# EAGLE schematic breadboard_rev01 (EAGLE 6.1)
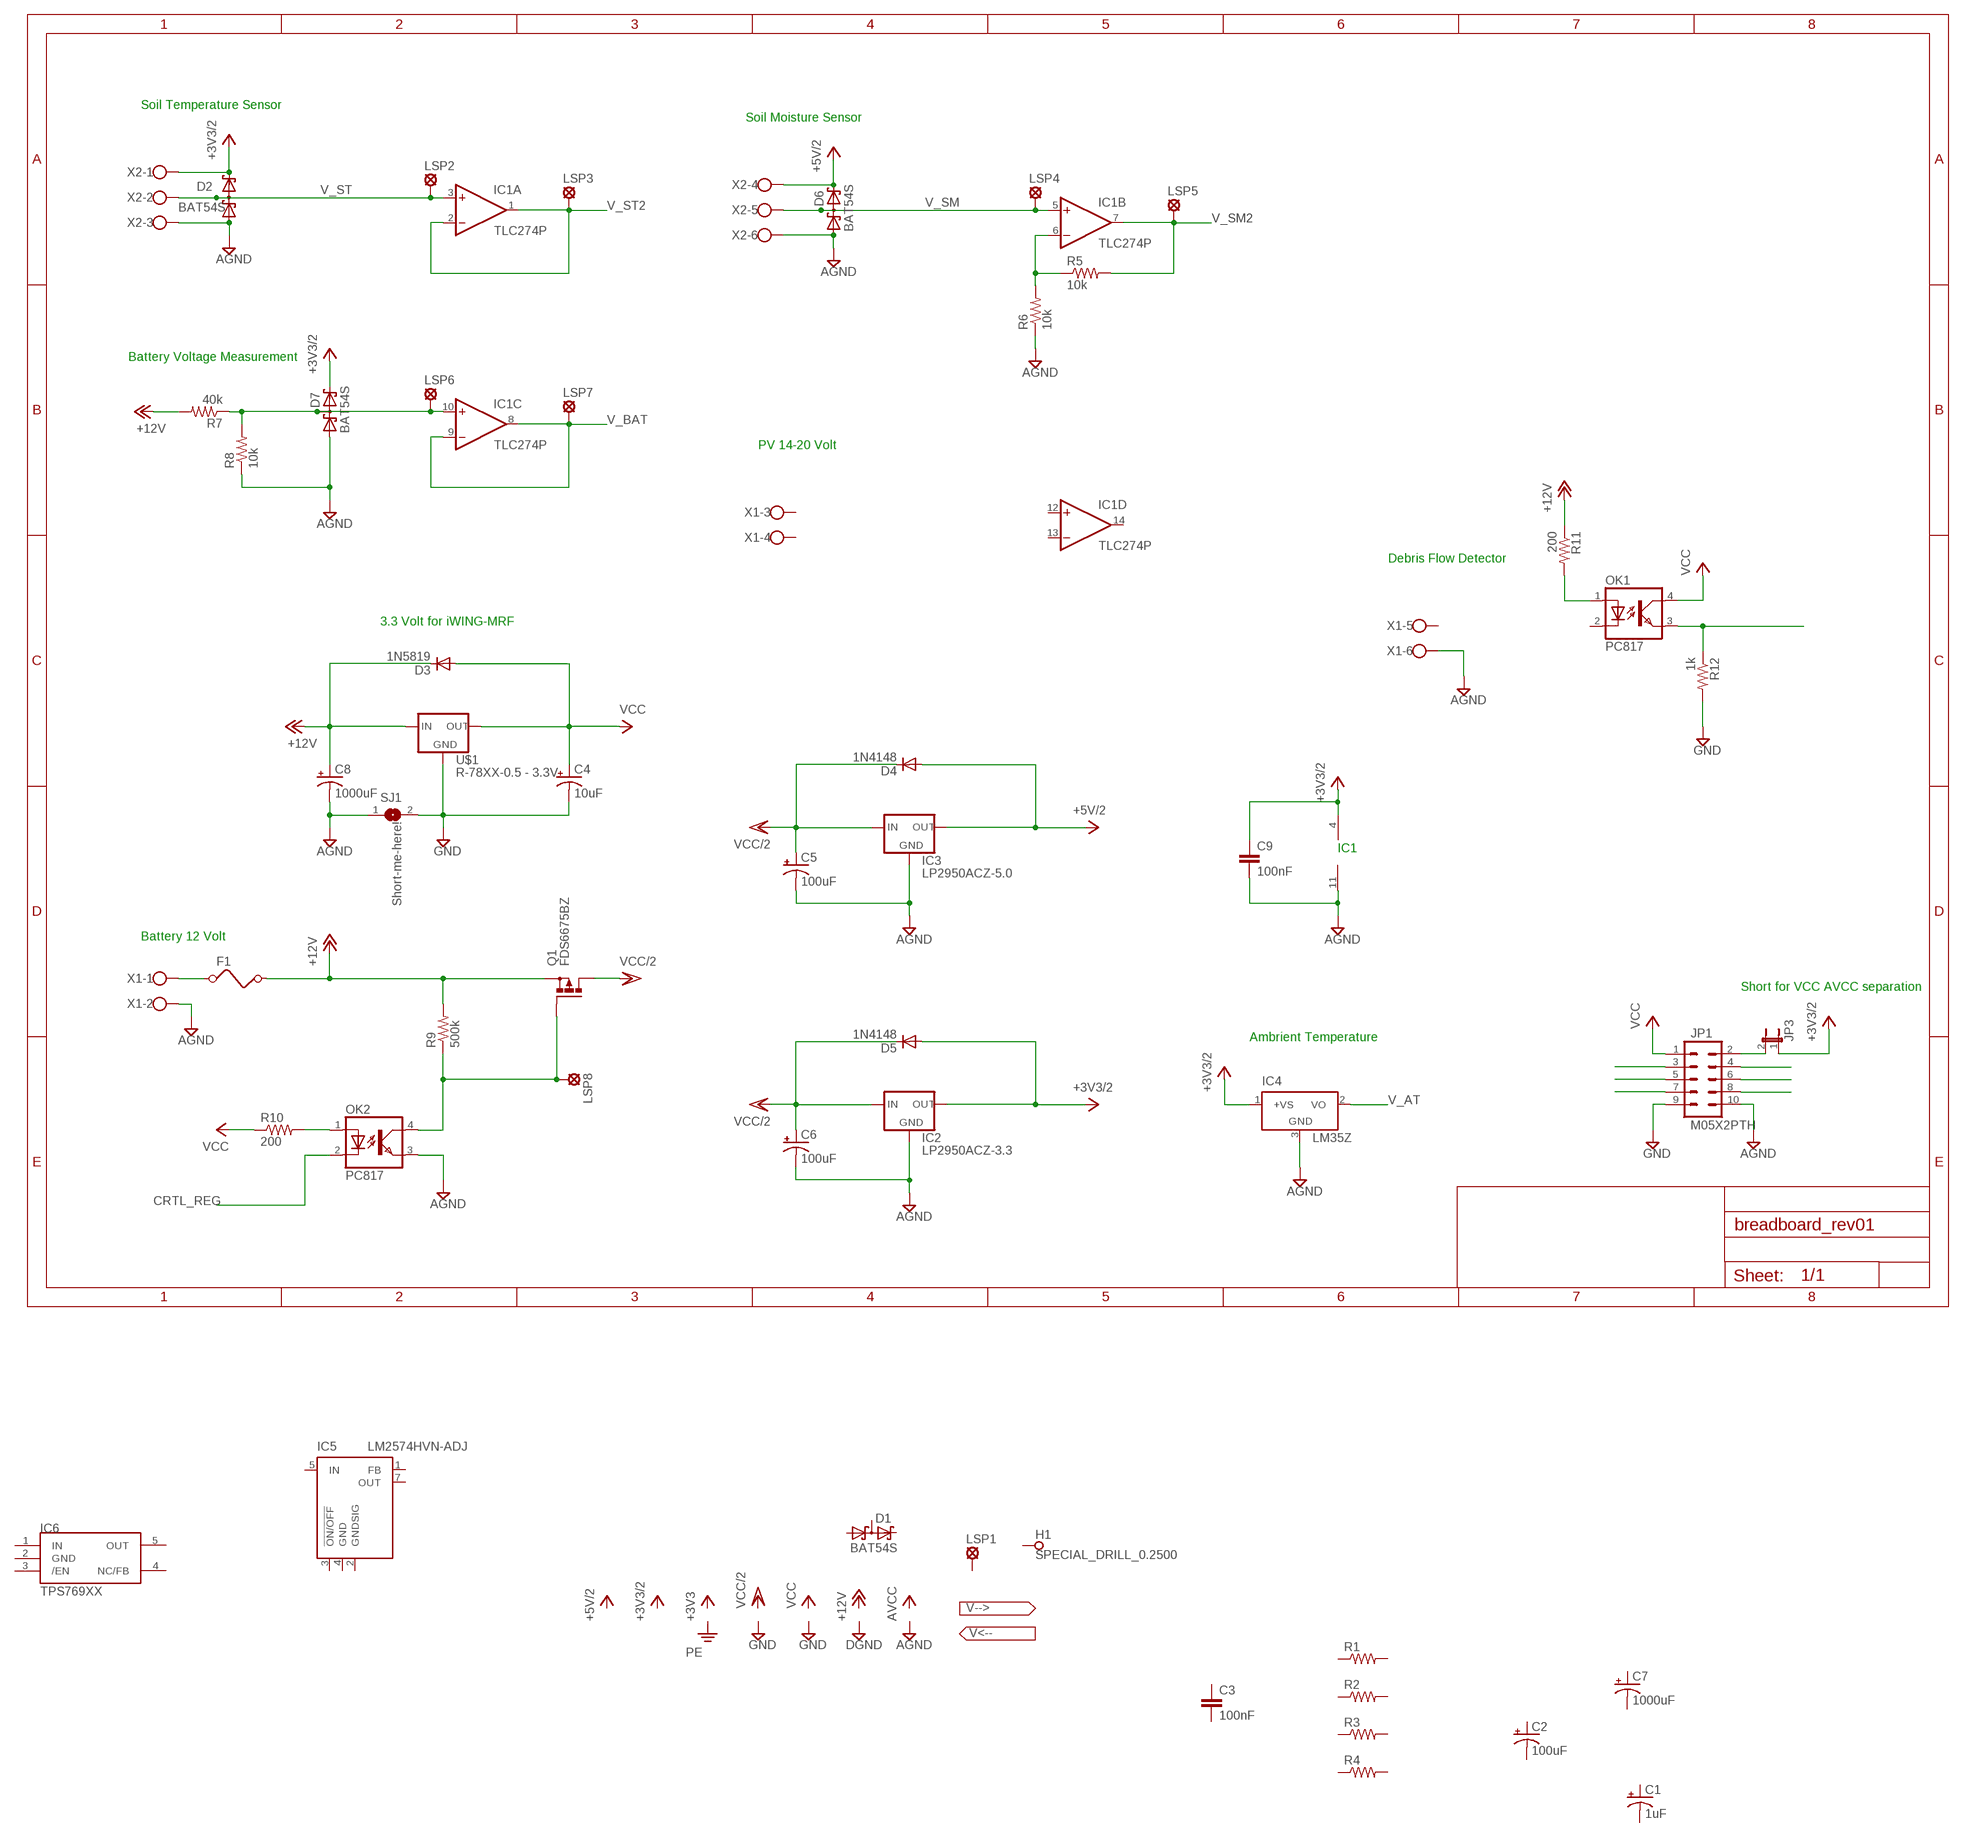
[diagram p0: schematic, sheet 1]

## Parts
C1  1uF  RCL_CPOL-USE2-5  [RCL_E2-5]
C2  100uF  RCL_CPOL-USE2.5-7  [RCL_E2,5-7]
C3  100nF  RCL_C-EU050-025X075  [RCL_C050-025X075]
C4  10uF  RCL_CPOL-USE2.5-7  [RCL_E2,5-7]
C5  100uF  RCL_CPOL-USE2.5-7  [RCL_E2,5-7]
C6  100uF  RCL_CPOL-USE2.5-7  [RCL_E2,5-7]
C7  1000uF  RCL_CPOL-USE5-13  [RCL_E5-13]
C8  1000uF  RCL_CPOL-USE5-13  [RCL_E5-13]
C9  100nF  RCL_C-EU050-025X075  [RCL_C050-025X075]
D1  BAT54S  [SOT23]
D2  BAT54S  [SOT23]
D3  1N5819  [DO41-10]
D4  1N4148  [DO35-10]
D5  1N4148  [DO35-10]
D6  BAT54S  [SOT23]
D7  BAT54S  [SOT23]
F1  FUSE  [FUSE]
H1  SPECIAL_DRILL_0.2500  [PAD_0.2500]
IC1  TLC274P  [DIL14]
IC2  LP2950ACZ-3.3  [TO92]
IC3  LP2950ACZ-5.0  [TO92]
IC4  LM35Z  [TO92]
IC5  LM2574HVN-ADJ  [DIL08]
IC6  TPS769XX  [SOT23-5L]
JP1  M05X2PTH  [AVR_ICSP]
JP3  JP1E  [JUMPER_JP1]
LSP1  LSP13  [LSP13]
LSP2  LSP13  [LSP13]
LSP3  LSP13  [LSP13]
LSP4  LSP13  [LSP13]
LSP5  LSP13  [LSP13]
LSP6  LSP13  [LSP13]
LSP7  LSP13  [LSP13]
LSP8  LSP13  [LSP13]
OK1  PC817  [DIL04]
OK2  PC817  [DIL04]
Q1  FDS6675BZ  P-MOSFET-SO8  [SO-08]
R1  RCL_R-US_0204/7  [RCL_0204/7]
R2  RCL_R-US_0204/7  [RCL_0204/7]
R3  RCL_R-US_0204/7  [RCL_0204/7]
R4  RCL_R-US_0204/7  [RCL_0204/7]
R5  10k  RCL_R-US_0204/7  [RCL_0204/7]
R6  10k  RCL_R-US_0204/7  [RCL_0204/7]
R7  40k  RCL_R-US_0204/7  [RCL_0204/7]
R8  10k  RCL_R-US_0204/7  [RCL_0204/7]
R9  500k  RCL_R-US_0204/7  [RCL_0204/7]
R10  200  RCL_R-US_0204/7  [RCL_0204/7]
R11  200  RCL_R-US_0204/7  [RCL_0204/7]
R12  1k  RCL_R-US_0204/7  [RCL_0204/7]
SJ1  Short-me-here!  SJ  [SJ]
U$1  R-78XX-0.5 - 3.3V  R-78XX-0.5  [SIP3]
X1  5EHDRC-6P  [5EHDRC-6P]
X2  5EHDRC-6P  [5EHDRC-6P]

## Nets
+3V3/2: C9.1 D2.3(C2) D5.A D7.3(C2) IC1.4(P:V+) IC2.1(OUT) IC4.1(+VS) JP3.1 X2.1
+5V/2: D4.A D6.3(C2) IC3.1(OUT) X2.4
+12V: C8.+ F1.2 Q1.1(S) Q1.2(S) Q1.3(S) R7.2 R9.2 R11.1 U$1.1(IN)
AGND: C5.- C6.- C8.- C9.2 D2.1(A1) D6.1(A1) D7.1(A1) IC1.11(P:V-) IC2.2(GND) IC3.2(GND) IC4.3(GND) JP1.10 OK2.3(EMIT) R6.1 R8.1 SJ1.1 X1.2 X1.6 X2.3 X2.6
CRTL_REG: OK2.2(C)
GND: C4.- JP1.9 R12.2 SJ1.2 U$1.2(GND)
N$1: D7.2(C1A2) IC1.10(C:+IN) LSP6.MP R7.1 R8.2
N$2: F1.1 X1.1
N$3: IC1.6(B:-IN) R5.1 R6.2
N$4: JP1.3
N$5: JP1.5
N$6: JP1.7
N$7: JP1.4
N$8: JP1.6
N$9: JP1.8
N$10: LSP8.MP OK2.4(COL) Q1.4(G) R9.1
N$11: D3.C
N$12: D3.A
N$13: JP1.2 JP3.2
N$14: OK1.1(A) R11.2
N$16: OK2.1(A) R10.2
N$17: OK1.3(EMIT) R12.1
V_AT: IC4.2(VO)
V_BAT: IC1.8(C:OUT) IC1.9(C:-IN) LSP7.MP
V_SM: D6.2(C1A2) IC1.5(B:+IN) LSP4.MP X2.5
V_SM2: IC1.7(B:OUT) LSP5.MP R5.2
V_ST: D2.2(C1A2) IC1.3(A:+IN) LSP2.MP X2.2
V_ST2: IC1.1(A:OUT) IC1.2(A:-IN) LSP3.MP
VCC: C4.+ JP1.1 OK1.4(COL) R10.1 U$1.3(OUT)
VCC/2: C5.+ C6.+ D4.C D5.C IC2.3(IN) IC3.3(IN) Q1.5(D) Q1.6(D) Q1.7(D) Q1.8(D)
Unconnected: C1.+ C1.- C2.+ C2.- C3.1 C3.2 C7.+ C7.- D1.1(A1) D1.2(C1A2) D1.3(C2) H1.1 IC1.12(D:+IN) IC1.13(D:-IN) IC1.14(D:OUT) IC5.1(FB) IC5.2(GNDSIG) IC5.3(!ON/OFF) IC5.5(IN) IC5.7(OUT) IC6.3(/EN) IC6.4(NC/FB) LSP1.MP OK1.2(C) R1.1 R1.2 R2.1 R2.2 R3.1 R3.2 R4.1 R4.2 X1.3 X1.4 X1.5

## Notes on the sheet
- Soil Temperature Sensor
- Soil Moisture Sensor
- Battery Voltage Measurement
- PV 14-20 Volt
- Debris Flow Detector
- 3.3 Volt for iWING-MRF
- IC1
- Battery 12 Volt
- Short for VCC AVCC separation
- Ambrient Temperature

## Power pins joined to a net without a drawn wire
GND: IC5.4(GND) IC6.2(GND)
IN: IC6.1(IN)
OUT: IC6.5(OUT)

## Library data of the parts
C1 C2 C4-C8 = SDI12IB_v0.5:RCL_CPOL-US: POLARIZED CAPACITOR, American symbol
C3 C9 = ipas:RCL_C-EU: CAPACITOR, European symbol
D1 D2 D6 D7 = diode:BAT54S: Schottky Diodes Source: Fairchild .. BAT54.pdf
D3 = ipas:1N5819: DIODE 1N5817 THRU 1N5819 1.0 AMP. Schottky Barrier Rectifiers Features Low forward voltage drop High current capability High reliability High surge current capability
D4 D5 = diode:1N4148: DIODE high speed (Philips)
F1 = special:FUSE: FUSE 5 x 20 mm
H1 = special-drill:SPECIAL_DRILL_: Special drills
IC1 = linear:TLC274: OP AMP
IC2 IC3 = v-reg:LP2950?*: Source: http://cache.national.com/ds/LP/LP2950.pdf
IC4 = ipas:LM35: Precision Centigrade Temperature Sensors Features Calibrated directly in ̊ Celsius (Centigrade) Linear + 10.0 mV/ ̊C scale factor 0.5 ̊C accuracy guaranteeable (at +25 ̊C) Rated for full −55 ̊ to +150 ̊C range Suitable for remote applications Low cost due to wafer-level trimming Operates from 4 to 30 volts Less than 60 μA current drain Low self-heating, 0.08 ̊C in still air Nonlinearity only ± 1⁄4 ̊C typical Low impedance output, 0.1 Ω for 1 mA load The LM35 series are precision integrated-circuit temperature sensors, whose output voltage is linearly proportional to the Celsius (Centigrade) temperature. The LM35 thus has an advantage over linear temperature sensors calibrated in ̊ Kelvin, as the user is not required to subtract a large constant voltage from its output to obtain convenient Centi- grade scaling. The LM35 does not require any external calibration or trimming to provide typical accuracies of ± 1⁄4 ̊C at room temperature and ± 3⁄4 ̊C over a full −55 to +150 ̊C temperature range. Low cost is assured by trimming and calibration at the wafer level. The LM35’s low output imped- ance, linear output, and precise inherent calibration make interfacing to readout or control circuitry especially easy. It can be used with single power supplies, or with plus and minus supplies. As it draws only 60 μA from its supply, it has very low self-heating, less than 0.1 ̊C in still air. The LM35 is rated to operate over a −55 ̊ to +150 ̊C temperature range, while the LM35C is rated for a −40 ̊ to +110 ̊C range (−10 ̊ with improved accuracy). The LM35 series is available pack- aged in hermetic TO-46 transistor packages, while the LM35C, LM35CA, and LM35D are also available in the plastic TO-92 transistor package. The LM35D is also avail- able in an 8-lead surface mount small outline package and a plastic TO-220 package. Source: http://cache.national.com/ds/LM/LM50.pdf
IC5 = linear:LM2574?-*: SIMPLE SWITCHER 0.5A Step-Down Voltage Regulator Source: http://cache.national.com/ds/LM/LM2574.pdf
IC6 = tps769xx:TPS769XX
JP1 = SparkFun-Connectors:M05X2: Header 5x2 Standard 10-pin dual row 0.1" header. Commonly used with AVR-ISP. Use with Spark Fun Electronics SKU: PRT-00778
JP3 = ipas:JP1E: JUMPER
LSP1-LSP8 = solpad:LSP13: SOLDER PAD drill 1.3 mm, distributor Buerklin, 12H562
OK1 OK2 = ipas:PC817: SHARP OPTO COUPLER; MPN: PC817X4J000F; OC_FARNELL: 9707727; OC_NEWARK: 97K7059
Q1 = transistor-power:P-MOSFET-SO8: P-Channel MOSFET Example: FDS4435A; P-Channel Logic Level PowerTrench® MOSFET FDS4465; P-Channel 1.8V Specified PowerTrench® MOSFET Source: www.fairchildsemi.com
R1-R12 = SDI12IB_v0.5:RCL_R-US_: RESISTOR, American symbol
SJ1 = jumper:SJ: SMD solder JUMPER
U$1 = ipas:R-78XX-0.5: The R-78xx-Series high efficiency switching regulators are ideally suited to replace 78xx linear regulators and are pin compatible. The efficiency of up to 97% means that very little energy is wasted as heat so there is no need for any heat sinks with their additional space and mounting costs. Low ripple and noise figures and short circuit , overload and over- temperature protection round off the specifications of this versatile converter series.This R-78xx-0.5 is fully certified to EN 60601-1-2 (Medical Equipment), EN 55022 (Emissions), and EN55024 (Immunity) EMC Standards and for EN-60950-1 Safety.
X1 X2 = ipas:5EHDRC-6P: Dinkle Headers(Sockets) for pluggable terminal blocks / ECH & EHD series TERMINAL BLOCK, 300V/15A